# Altium schematic sheet Communications.SchDoc: Communications
size A4; CompanyName: HEIG-VD; Organization: Institut d'Automatisation Industrielle; SheetNumber: 6; SheetTotal: 6; SheetFormat: A4; CurrentTime: 6; CurrentDate: 5; DocumentFullPathAndName: 8; DocumentName: 9; ModifiedDate: 13; ProjectName: <projet>
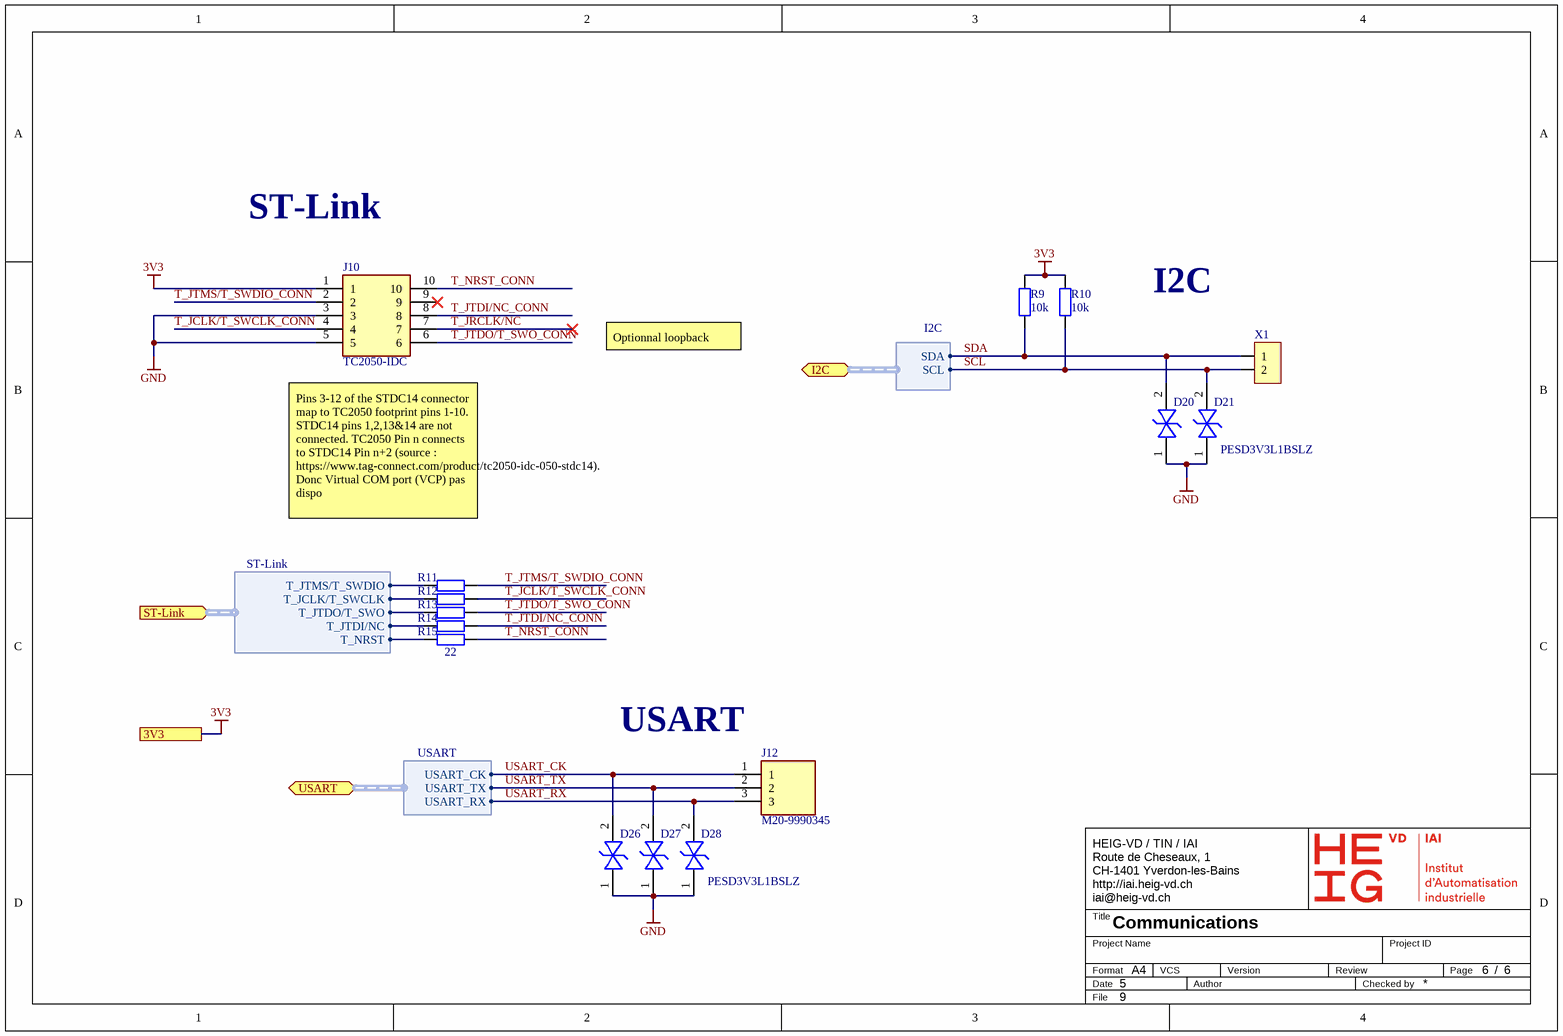
[diagram p0: Communications.SchDoc]

## Parts
D20  PESD3V3L1BSLZ  [PESD3V3L1BSLZ]  (value not drawn)
D21  PESD3V3L1BSLZ  [PESD3V3L1BSLZ]
D26  PESD3V3L1BSLZ  [PESD3V3L1BSLZ]  (value not drawn)
D27  PESD3V3L1BSLZ  [PESD3V3L1BSLZ]  (value not drawn)
D28  PESD3V3L1BSLZ  [PESD3V3L1BSLZ]
J10  TC2050-IDC  [TC2050-IDC]
J12  M20-9990345  [HDRV3W64P0X254_1X3_762X254X864P]
R9  10k  [RESC1608X04N]
R10  10k  [RESC1608X04N]
R11  22  [RESC1608X04N]  (value not drawn)
R12  22  [RESC1608X04N]  (value not drawn)
R13  22  [RESC1608X04N]  (value not drawn)
R14  22  [RESC1608X04N]  (value not drawn)
R15  22  [RESC1608X04N]
X1  CONN HEADER VERT 2POS 2.54MM  [CONN HEADER VERT 2POS 2.54MM]  (value not drawn)

## Ports
3V3, I2C (bidir, harness I2C), ST-Link (in, harness ST-Link), USART (bidir, harness USART)

## Harnesses
I2C: SDA, SCL
ST-Link: T_JTMS/T_SWDIO, T_JCLK/T_SWCLK, T_JTDO/T_SWO, T_NRST, T_JTDI/NC
USART: USART_CK, USART_RX, USART_TX

## Nets
3V3: J10.1 R9.2 R10.2 ; port 3V3
GND: D20.1(K1) D21.1(K1) D26.1(K1) D27.1(K1) D28.1(K1) J10.3 J10.5
SCL: D21.2(K2) R10.1 X1.2 ; port I2C.SCL
SDA: D20.2(K2) R9.1 X1.1 ; port I2C.SDA
T_JCLK/T_SWCLK_CONN: J10.4 R12.2
T_JRCLK/NC: J10.7
T_JTDI/NC_CONN: J10.8 R14.2
T_JTDO/T_SWO_CONN: J10.6 R13.2
T_JTMS/T_SWDIO_CONN: J10.2 R11.2
T_NRST_CONN: J10.10 R15.2
USART_CK: D26.2(K2) J12.1 ; port USART.USART_CK
USART_RX: D28.2(K2) J12.3 ; port USART.USART_RX
USART_TX: D27.2(K2) J12.2 ; port USART.USART_TX
NetR11_1: R11.1 ; port ST-Link.T_JTMS/T_SWDIO
NetR12_1: R12.1 ; port ST-Link.T_JCLK/T_SWCLK
NetR13_1: R13.1 ; port ST-Link.T_JTDO/T_SWO
NetR14_1: R14.1 ; port ST-Link.T_JTDI/NC
NetR15_1: R15.1 ; port ST-Link.T_NRST

Not connected (* = marked no-connect by the designer): J10 9*

## Notes on the sheet
- ST-Link
- I2C
- Optionnal loopback
- (near J10) Pins 3-12 of the STDC14 connector map to TC2050 footprint pins 1-10. STDC14 pins 1,2,13&14 are not connected. TC2050 Pin n connects to STDC14 Pin n+2 (source : https://www.tag-connect.com/product/tc2050-idc-050-stdc14). Donc Virtual COM port (VCP) pas dispo
- USART
- Title
- HEIG-VD / TIN / IAI
  Route de Cheseaux, 1
  CH-1401 Yverdon-les-Bains
  http://iai.heig-vd.ch
  iai@heig-vd.ch
- Format
- Date
- Project Name
- VCS
- Author
- Version
- Review
- Checked by
- Project ID
- Page
- /
- File

## Library data of the parts
D20 D21 D26-D28 = PESD3V3L1BSLZ: Diode ESD (Bi-directional); Manufacturer_Name: Nexperia; Datasheet Link: https://assets.nexperia.com/documents/data-sheet/PESD3V3L1BSL.pdf; Height: 0.45mm; Manufacturer_Part_Number: PESD3V3L1BSLZ; Mouser Part Number: 771-PESD3V3L1BSLZ; Mouser Price/Stock: https://www.mouser.co.uk/ProductDetail/Nexperia/PESD3V3L1BSLZ?qs=Li%252BoUPsLEnsrB%2FnSgNrAWw%3D%3D
J10 = TC2050-IDC: Connector; Manufacturer_Name: Tag Connect; Datasheet Link: https://datasheet.datasheetarchive.com/originals/distributors/Datasheets_SAMA/51f607a36a24a0aceedaa5d6ebc30014.pdf; Manufacturer_Part_Number: TC2050-IDC; System: Connector
J12 = M20-9990345: Connector; Manufacturer_Name: Harwin; Datasheet Link: https://cdn.harwin.com/pdfs/M20-999.pdf; Height: 8.64mm; Manufacturer_Part_Number: M20-9990345; Mouser Part Number: 855-M20-9990345; Mouser Price/Stock: https://www.mouser.co.uk/ProductDetail/Harwin/M20-9990345?qs=ulE8k0yEMYbl6ZPCtNdmpA%3D%3D; System: Connector
R9 R10 = CMP-0004349-2: 10 kOhms ±0.1% 0.1W, 1/10W Chip Resistor 0603 (1608 Metric) Thin Film; Power: 100mW; Temperature Coefficient: 25ppm/°C; Resistor Series: E96; Voltage Rating: 75V; Max Operating Temperature: 155°C; Min Operating Temperature: -55°C; Value: 10k; RoHS Compliant: Yes; Case/Package: 0603 (1608 Metric); Mounting Technology: Surface Mount; Tolerance: 0.1%
R11-R15 = CMP-0001940-3: 22 Ohms ±1% 0.1W, 1/10W Chip Resistor 0603 (1608 Metric) Moisture Resistant Thick Film; Power: 100mW; Temperature Coefficient: 200ppm/°C; Resistor Series: E24; Voltage Rating: 75V; Mounting Technology: Surface Mount; RoHS Compliant: Yes; Value: 22; Max Operating Temperature: 155°C; Tolerance: 1%; Min Operating Temperature: -55°C; Case/Package: 0603 (1608 Metric)
X1 = CMP-0002184-3: Connector Header Through Hole 2 position 0.100" (2.54mm); Number of Positions: 2; Contact Length: 11.54mm; Shrouding: Unshrouded; Row Spacing: 0mm; Current Rating: 3A; RoHS Compliant: Yes; Pitch: 2.54mm; Max Operating Temperature: 105°C; Mounting Technology: Through Hole; Min Operating Temperature: -40°C; Contact Shape: Square; Number of Rows: 1; System: Connector